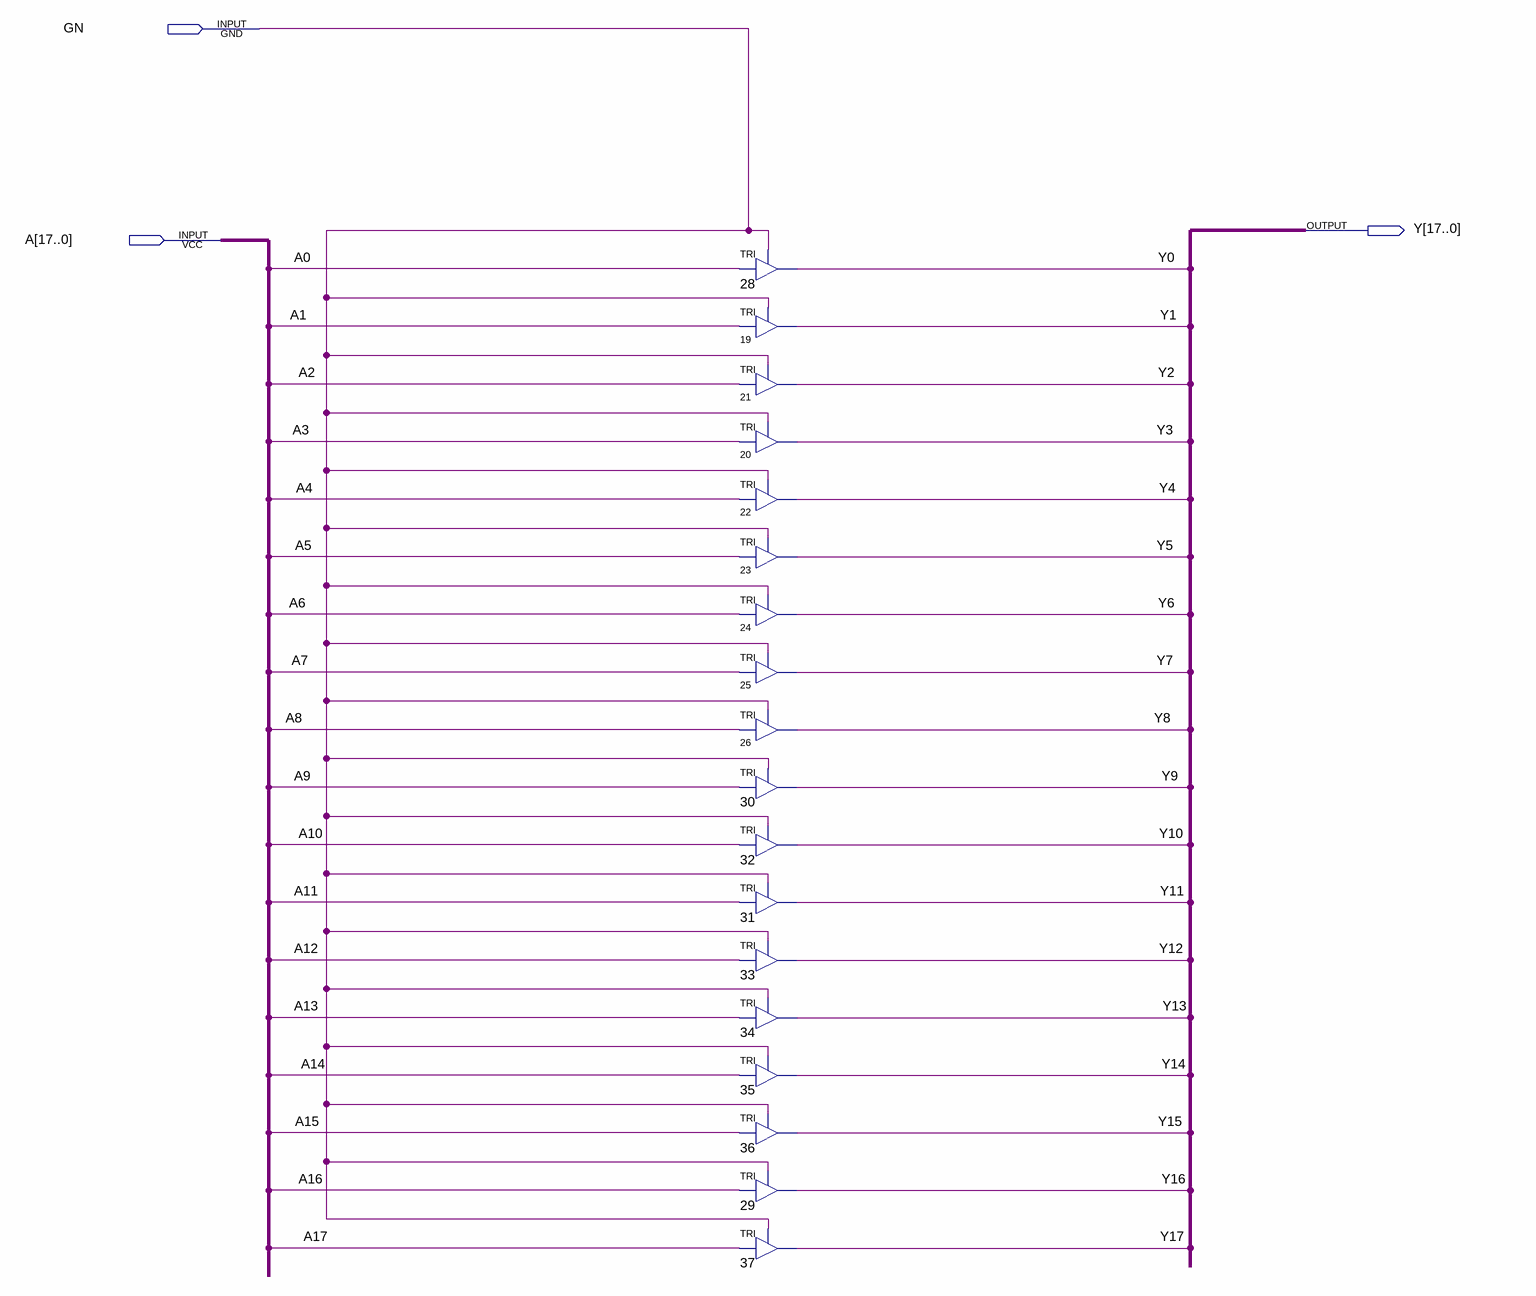
[diagram p0: schematic sheet]
// Quartus schematic buf18_29nov.bdf as structural Verilog: 18 symbols, 3 pins
module buf18_29nov (
  input  GN,
  input  [17:0] A,
  output [17:0] Y
);

  TRI u_28 (.IN(A[0]), .OE(GN), .OUT(Y[0]));
  TRI u_19 (.IN(A[1]), .OE(GN), .OUT(Y[1]));
  TRI u_21 (.IN(A[2]), .OE(GN), .OUT(Y[2]));
  TRI u_20 (.IN(A[3]), .OE(GN), .OUT(Y[3]));
  TRI u_22 (.IN(A[4]), .OE(GN), .OUT(Y[4]));
  TRI u_23 (.IN(A[5]), .OE(GN), .OUT(Y[5]));
  TRI u_24 (.IN(A[6]), .OE(GN), .OUT(Y[6]));
  TRI u_25 (.IN(A[7]), .OE(GN), .OUT(Y[7]));
  TRI u_26 (.IN(A[8]), .OE(GN), .OUT(Y[8]));
  TRI u_30 (.IN(A[9]), .OE(GN), .OUT(Y[9]));
  TRI u_32 (.IN(A[10]), .OE(GN), .OUT(Y[10]));
  TRI u_31 (.IN(A[11]), .OE(GN), .OUT(Y[11]));
  TRI u_33 (.IN(A[12]), .OE(GN), .OUT(Y[12]));
  TRI u_34 (.IN(A[13]), .OE(GN), .OUT(Y[13]));
  TRI u_35 (.IN(A[14]), .OE(GN), .OUT(Y[14]));
  TRI u_36 (.IN(A[15]), .OE(GN), .OUT(Y[15]));
  TRI u_29 (.IN(A[16]), .OE(GN), .OUT(Y[16]));
  TRI u_37 (.IN(A[17]), .OE(GN), .OUT(Y[17]));
endmodule
